# EAGLE schematic rc-light-controller (EAGLE 6.5.0)
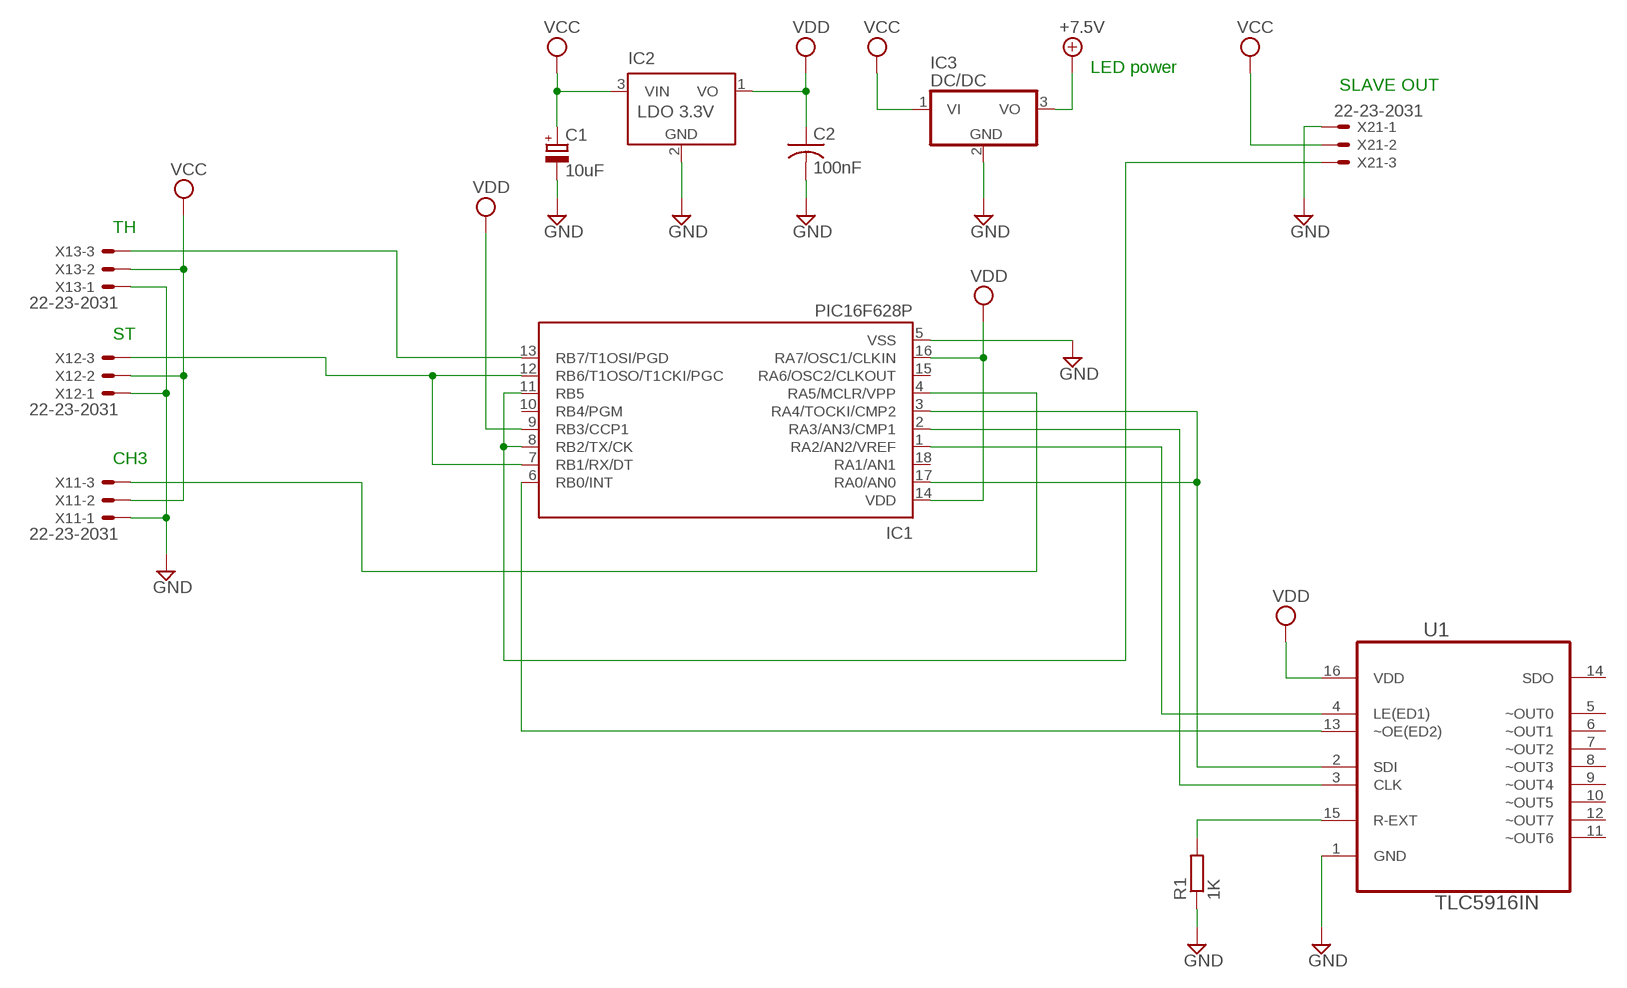
[diagram p0: schematic, sheet 1]

## Parts
C1  10uF  CPOL-EUE5-5  [E5-5]
C2  100nF  C-US025-025X050  [C025-025X050]
IC1  PIC16F628P  [DIL18]
IC2  LDO 3.3V  LM2936Z-3.3  [TO92]
IC3  DC/DC  7805T  [TO220H]
R1  1K  R-EU_0204/7  [0204/7]
U1  TLC5916IN  [DIP254P762X508-16]
X11  22-23-2031  [22-23-2031]
X12  22-23-2031  [22-23-2031]
X13  22-23-2031  [22-23-2031]
X21  22-23-2031  [22-23-2031]

## Nets
+9V: IC3.3(VO) ; supply symbol labelled +7.5V
GND: C1.- C2.2 IC1.5(VSS) IC2.2(GND) IC3.2(GND) R1.1 U1.1(GND) X11.1 X12.1 X13.1 X21.1
N$1: R1.2 U1.15(R-EXT)
N$2: IC1.2(RA3/AN3/CMP1) U1.3(CLK)
N$3: IC1.3(RA4/TOCKI/CMP2) IC1.17(RA0/AN0) U1.2(SDI)
N$4: IC1.4(RA5/MCLR/VPP) X11.3
N$5: IC1.7(RB1/RX/DT) IC1.12(RB6/T1OSO/T1CKI/PGC) X12.3
N$6: IC1.13(RB7/T1OSI/PGD) X13.3
N$7: IC1.1(RA2/AN2/VREF) U1.4(LE(ED1))
N$8: IC1.6(RB0/INT) U1.13(~OE(ED2))
N$23: IC1.8(RB2/TX/CK) IC1.11(RB5) X21.3
VCC: C1.+ IC2.3(VIN) IC3.1(VI) X11.2 X12.2 X13.2 X21.2
VDD: C2.1 IC1.9(RB3/CCP1) IC1.14(VDD) IC1.16(RA7/OSC1/CLKIN) IC2.1(VO) U1.16(VDD)
Unconnected: IC1.10(RB4/PGM) IC1.15(RA6/OSC2/CLKOUT) IC1.18(RA1/AN1) U1.5(~OUT0) U1.6(~OUT1) U1.7(~OUT2) U1.8(~OUT3) U1.9(~OUT4) U1.10(~OUT5) U1.11(~OUT6) U1.12(~OUT7) U1.14(SDO)

## Notes on the sheet
- LED power
- SLAVE OUT
- TH
- ST
- CH3

## Library data of the parts
C1 = resistor:CPOL-EU: POLARIZED CAPACITOR, European symbol
C2 = rcl:C-US: CAPACITOR, American symbol
IC1 = microchip:PIC16F62*: FLASH-Based 8-Bit CMOS Microcontroller Source: http://ww1.microchip.com/downloads/en/DeviceDoc/40300C.pdf
IC2 = national-semiconductor:LM2936?*: Ultra-Low Quiescent Current LDO Voltage Regulator Source: Data sheet <http://www.national.com/ds/LM/LM2936.pdf>; MF: NATIONAL SEMICONDUCTOR; MPN: LM2936Z-3.3/NOPB; OC_FARNELL: 1564641; OC_NEWARK: 41K4532
IC3 = linear:78*: Positive VOLTAGE REGULATOR Source: http://cache.national.com/ds/LM/LM78L05.pdf http://www.fairchildsemi.com/ds/LM/LM7805.pdf
R1 = resistor:R-EU_: RESISTOR, European symbol
U1 = TI-TLC5916IN:TLC5916IN: 8-CHANNEL CONSTANT-CURRENT LED SINK DRIVERS; MPN: TLC5916IN; OC_FARNELL: 1647814; OC_NEWARK: 60M1749; PACKAGE: PDIP-16; SUPPLIER: Texas Instruments
X11-X13 X21 = con-molex:22-23-2031: .100" (2.54mm) Center Header - 3 Pin